# EAGLE design M240B (EAGLE 4.11)
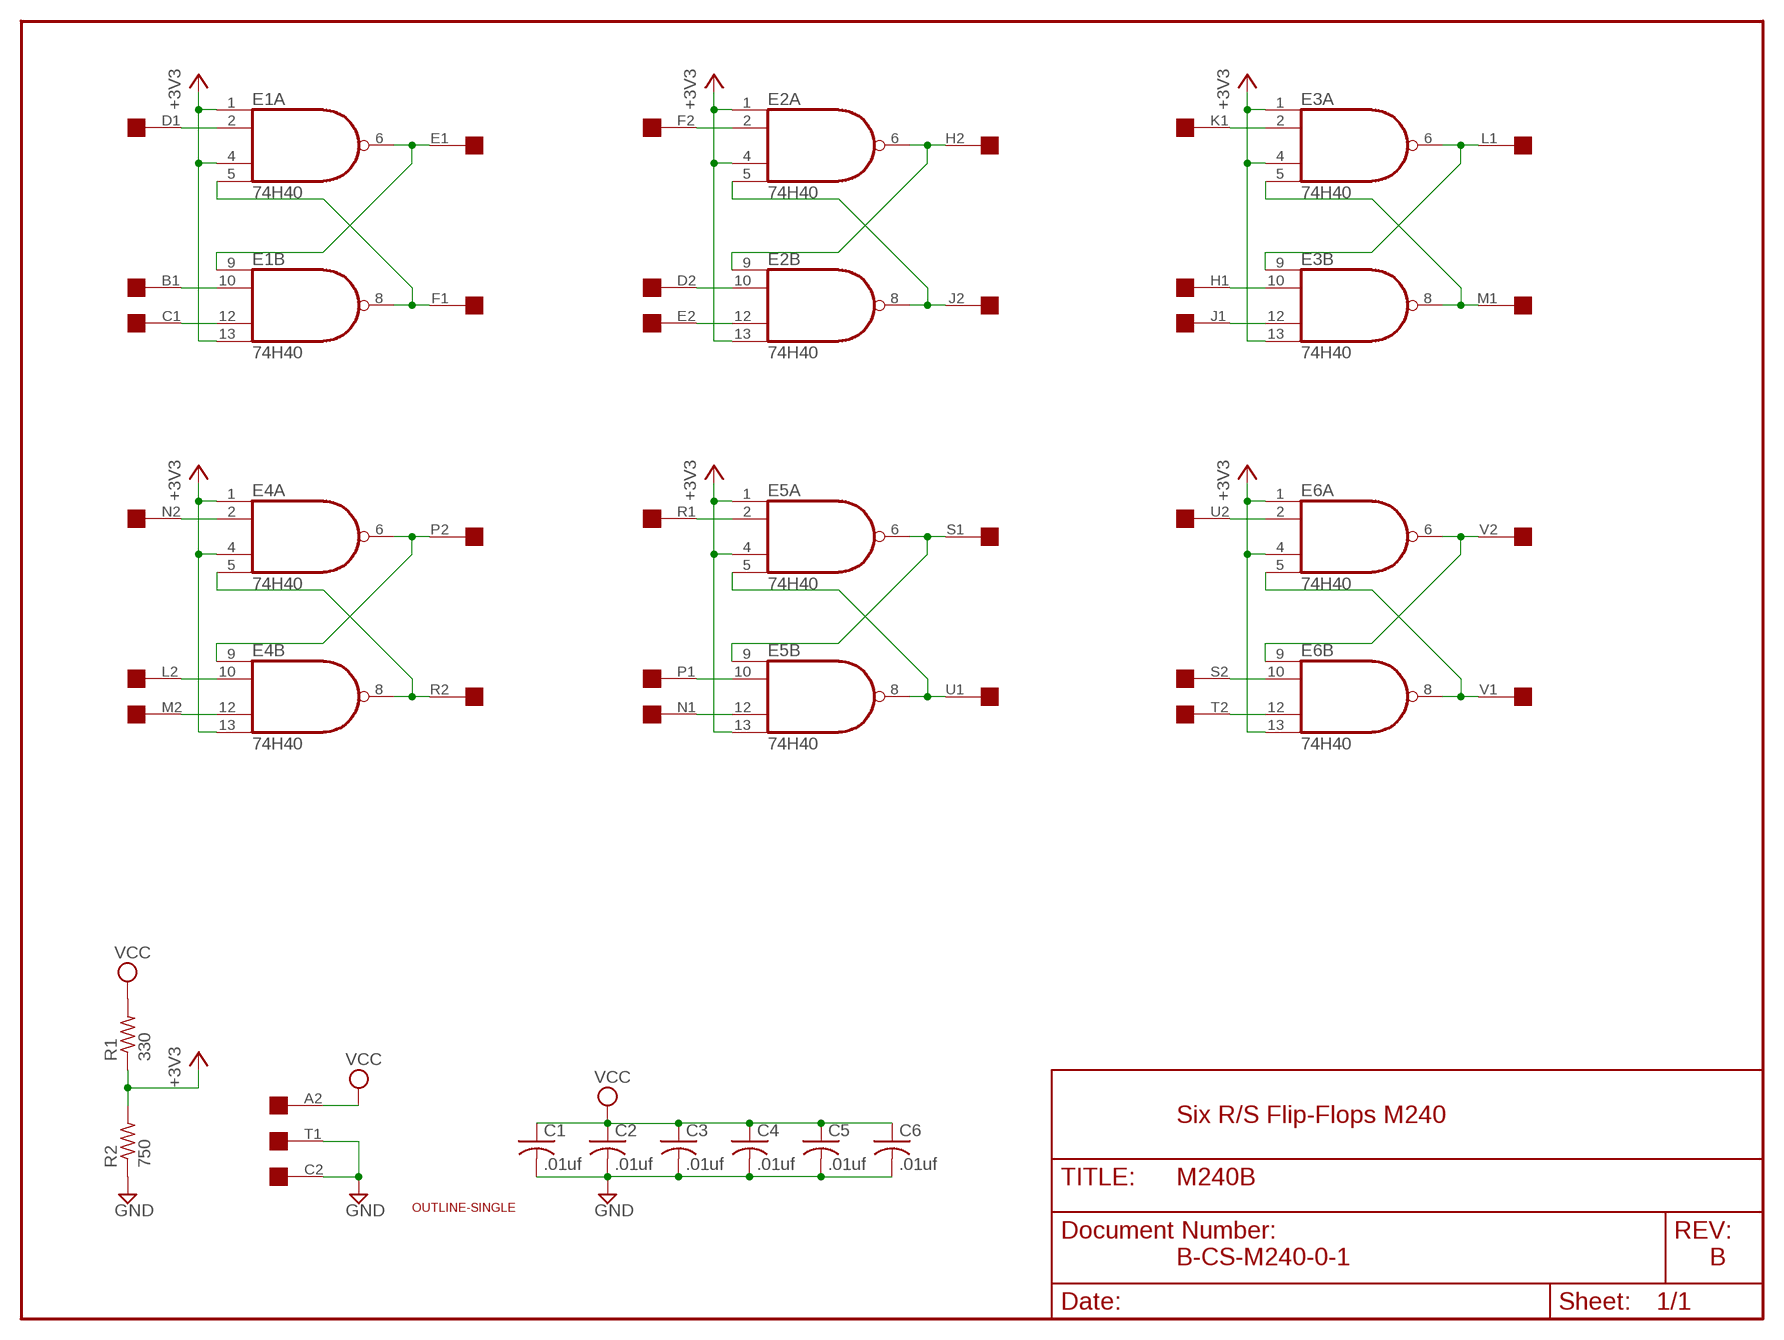
[diagram p0: schematic, sheet 1]

## Parts
C1  .01uf  C-US050-025X075  [C050-025X075]
C2  .01uf  C-US050-025X075  [C050-025X075]
C3  .01uf  C-US050-025X075  [C050-025X075]
C4  .01uf  C-US050-025X075  [C050-025X075]
C5  .01uf  C-US050-025X075  [C050-025X075]
C6  .01uf  C-US050-025X075  [C050-025X075]
E1  74H40  74S20N  [DIL14]
E2  74H40  74S20N  [DIL14]
E3  74H40  74S20N  [DIL14]
E4  74H40  74S20N  [DIL14]
E5  74H40  74S20N  [DIL14]
E6  74H40  74S20N  [DIL14]
R1  330  R-US_0207/10  [0207/10]
R2  750  R-US_0207/10  [0207/10]
U$1  OUTLINE-SINGLE  [SINGLE]
U$4  SINGLE  [EDGE-CON2]

## Nets
+3V3: E1.1(A:I0) E1.4(A:I2) E1.13(B:I3) E2.1(A:I0) E2.4(A:I2) E2.13(B:I3) E3.1(A:I0) E3.4(A:I2) E3.13(B:I3) E4.1(A:I0) E4.4(A:I2) E4.13(B:I3) E5.1(A:I0) E5.4(A:I2) E5.13(B:I3) E6.1(A:I0) E6.4(A:I2) E6.13(B:I3) R1.1 R2.2
GND [Supply]: C1.2 C2.2 C3.2 C4.2 C5.2 C6.2 R2.1 U$4.C2 U$4.T1
N$14: E1.6(A:O) E1.9(B:I0) U$4.E1
N$41: E1.5(A:I3) E1.8(B:O) U$4.F1
N$43: E1.2(A:I1) U$4.D1
N$44: E1.10(B:I1) U$4.B1
N$45: E1.12(B:I2) U$4.C1
N$46: E2.6(A:O) E2.9(B:I0) U$4.H2
N$47: E2.5(A:I3) E2.8(B:O) U$4.J2
N$48: E2.2(A:I1) U$4.F2
N$49: E2.10(B:I1) U$4.D2
N$50: E2.12(B:I2) U$4.E2
N$51: E3.6(A:O) E3.9(B:I0) U$4.L1
N$52: E3.5(A:I3) E3.8(B:O) U$4.M1
N$53: E3.2(A:I1) U$4.K1
N$54: E3.10(B:I1) U$4.H1
N$55: E3.12(B:I2) U$4.J1
N$56: E4.6(A:O) E4.9(B:I0) U$4.P2
N$57: E4.5(A:I3) E4.8(B:O) U$4.R2
N$58: E4.2(A:I1) U$4.N2
N$59: E4.10(B:I1) U$4.L2
N$60: E4.12(B:I2) U$4.M2
N$61: E5.6(A:O) E5.9(B:I0) U$4.S1
N$62: E5.5(A:I3) E5.8(B:O) U$4.U1
N$63: E5.2(A:I1) U$4.R1
N$64: E5.10(B:I1) U$4.P1
N$65: E5.12(B:I2) U$4.N1
N$66: E6.6(A:O) E6.9(B:I0) U$4.V2
N$67: E6.5(A:I3) E6.8(B:O) U$4.V1
N$68: E6.2(A:I1) U$4.U2
N$69: E6.10(B:I1) U$4.S2
N$70: E6.12(B:I2) U$4.T2
VCC [Supply]: C1.1 C2.1 C3.1 C4.1 C5.1 C6.1 R1.2 U$4.A2
Unconnected: U$4.A1 U$4.B2 U$4.K2

## Notes on the sheet
- Six R/S Flip-Flops M240
- B-CS-M240-0-1 | B

## Power pins joined to a net without a drawn wire
GND: E1.7(P:GND) E2.7(P:GND) E3.7(P:GND) E4.7(P:GND) E5.7(P:GND) E6.7(P:GND)
VCC: E1.14(P:VCC) E2.14(P:VCC) E3.14(P:VCC) E4.14(P:VCC) E5.14(P:VCC) E6.14(P:VCC)

## Library data of the parts
C1-C6 = rcl:C-US: CAPACITOR, American symbol
E1-E6 = 74xx-us:74*20: Dual 4-input NAND gate
R1 R2 = rcl:R-US_: RESISTOR, American symbol
U$1 = dec-con:OUTLINE-*: Board outlines for DEC boards.
U$4 = dec-con:SINGLE: Single-Height DEC board

## Net classes
1 Supply: width 0.813 mm

## Board
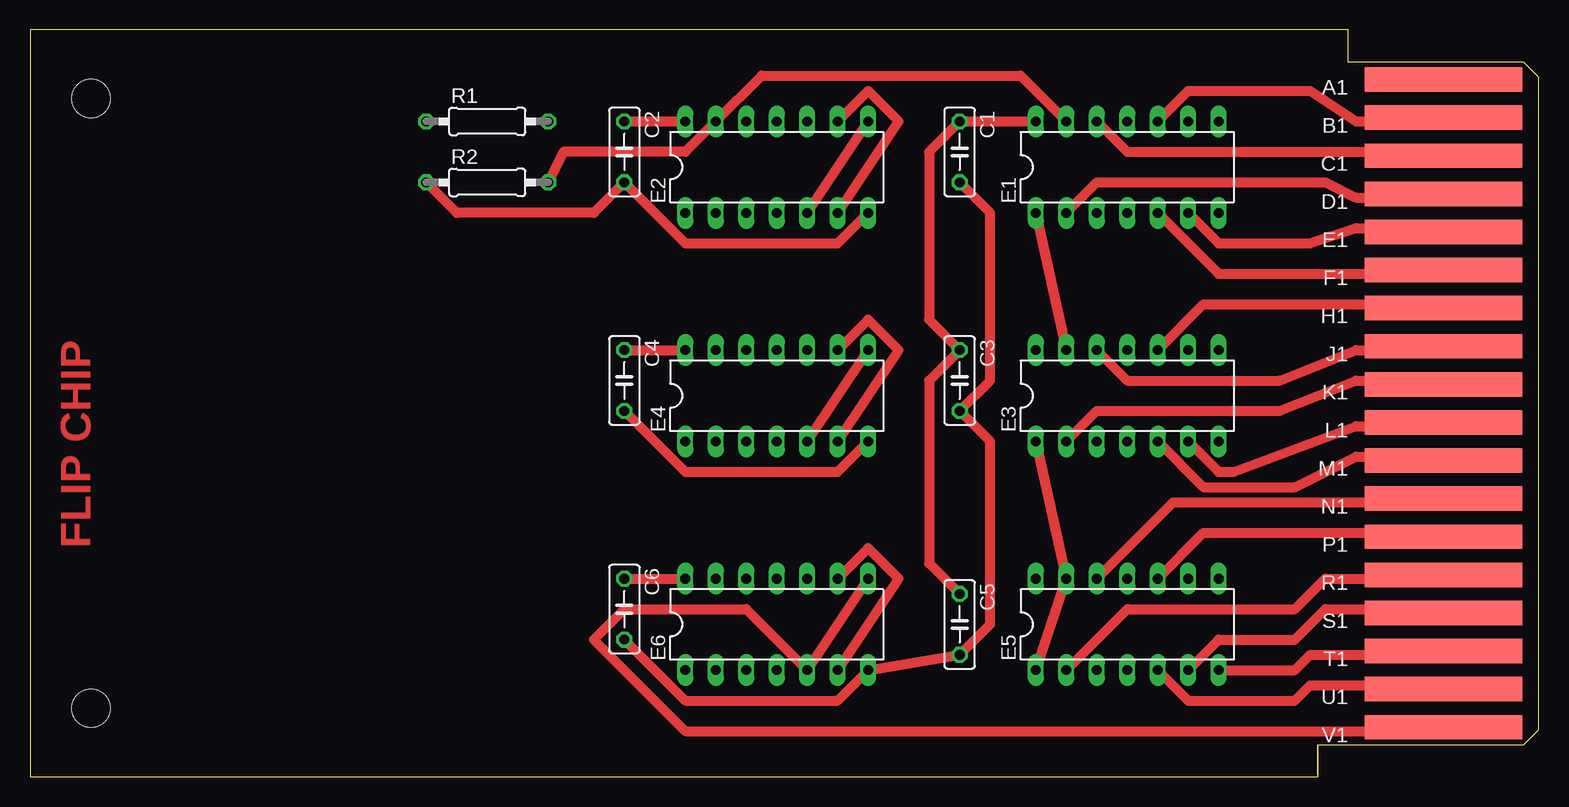
[diagram p1: board, top side]
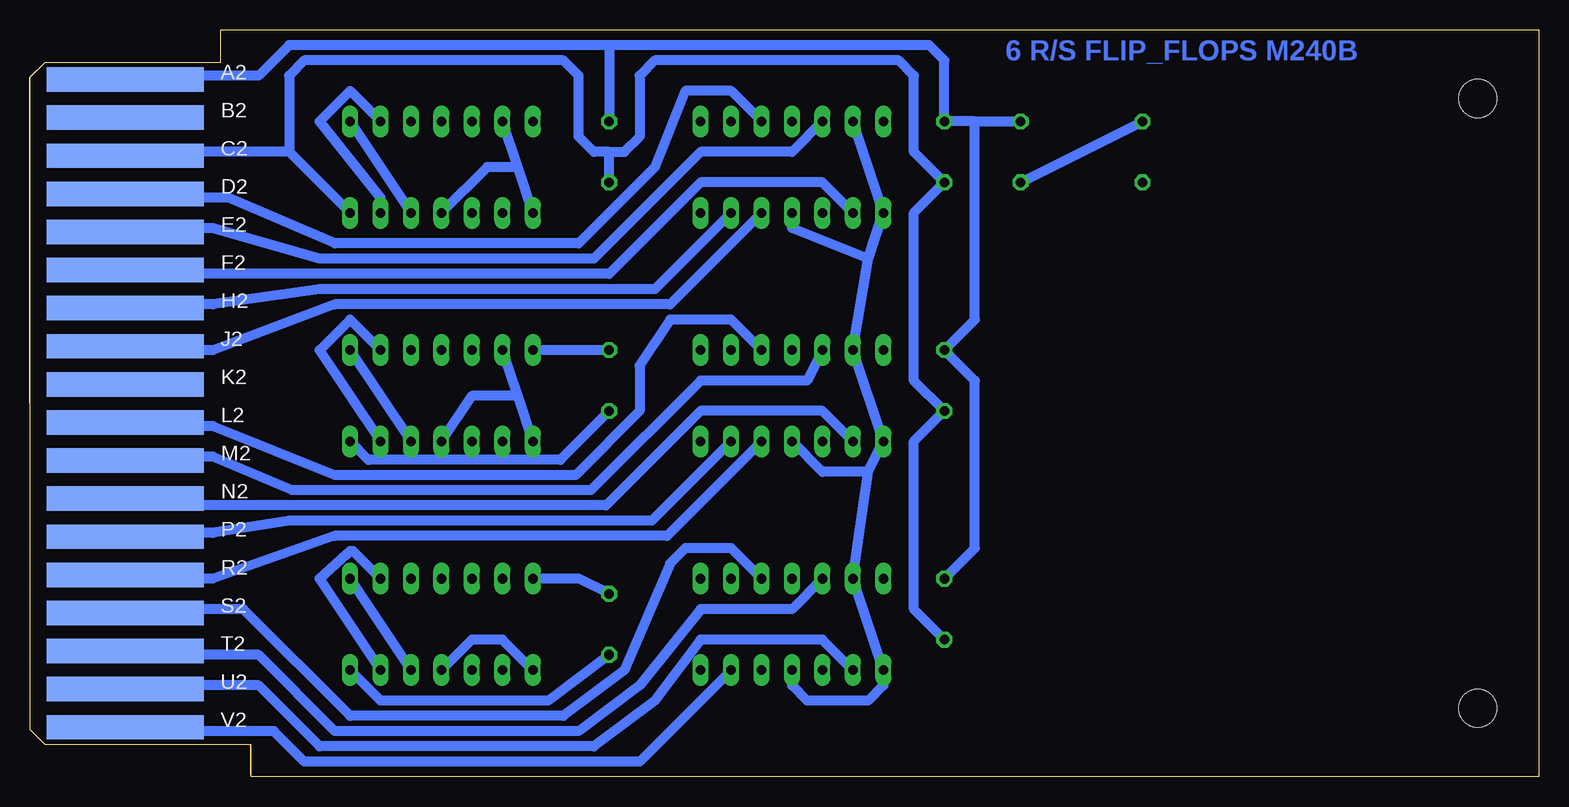
[diagram p2: board, bottom side, seen from below]

Size 125.73 x 62.23 mm. Coordinates in mm from the lower left corner, seen from the top.
Copper layers (1+16): Top 0.035mm / dielectric 1.5mm / Bottom 0.035mm
Design rules "16mils": minimum track width 16mil, minimum drill 32mil, track to track 15mil, track to pad 10mil, pad to pad 10mil, via to via 10mil, smd to smd 10mil, copper to edge 13mil, drill to drill 10mil, minimum pad ring 10mil, minimum via ring 8mil, stop-mask expansion 0mil, vias tented up to drill 0mil, thermal gap 10mil

### Footprints (pad centres in the part's own frame; a part is rotated, then mirrored left to right if it is on the bottom)
C050-025X075 = drill 0.813 octagon: 1 -2.54,0; 2 2.54,0
DIL14 = drill 0.813 long: 1 -7.62,-3.81; 2 -5.08,-3.81; 3 -2.54,-3.81; 4 0,-3.81; 5 2.54,-3.81; 6 5.08,-3.81; 7 7.62,-3.81; 8 7.62,3.81; 9 5.08,3.81; 10 2.54,3.81; 11 0,3.81; 12 -2.54,3.81; 13 -5.08,3.81; 14 -7.62,3.81
0207/10 = drill 0.813 octagon: 1 -5.08,0; 2 5.08,0
SINGLE = hole 3.175: 120.65,56.515; 120.65,5.715
EDGE-CON2 = smd 13.106 x 2.032: A1 7.938,4.128; B1 7.938,7.303; C1 7.938,10.477; D1 7.938,13.652; E1 7.938,16.828; F1 7.938,20.003; H1 7.938,23.177; J1 7.938,26.352; K1 7.938,29.527; L1 7.938,32.703; M1 7.938,35.877; N1 7.938,39.053; P1 7.938,42.227; R1 7.938,45.403; S1 7.938,48.578; T1 7.938,51.752; U1 7.938,54.928; V1 7.938,58.102 | smd 13.106 x 2.032 bottom: A2 7.938,4.128; B2 7.938,7.303; C2 7.938,10.477; D2 7.938,13.652; E2 7.938,16.828; F2 7.938,20.003; H2 7.938,23.177; J2 7.938,26.352; K2 7.938,29.527; L2 7.938,32.703; M2 7.938,35.877; N2 7.938,39.053; P2 7.938,42.227; R2 7.938,45.403; S2 7.938,48.578; T2 7.938,51.752; U2 7.938,54.928; V2 7.938,58.102

### Placement (x,y rotation side)
C1  77.47,52.07 270 top
C2  49.53,52.07 270 top
C3  77.47,33.02 270 top
C4  49.53,33.02 270 top
C5  77.47,12.7 270 top
C6  49.53,13.97 270 top
E1  91.44,50.8 0 top
E2  62.23,50.8 0 top
E3  91.44,31.75 0 top
E4  62.23,31.75 0 top
E5  91.44,12.7 0 top
E6  62.23,12.7 0 top
R1  38.1,54.61 0 top
R2  38.1,49.53 0 top
U$1  125.73,62.23 180 top
U$4  125.73,62.23 180 top
U$5  [FLIPCHIP]  0,0 0 top

### Tracks (layer width: path | path; a pad name or v marks a point on that pad's centre or on a via)
+3V3
  Top 0.813: R2.2 44.45,52.07 54.61,52.07 E2.13 60.96,58.42 82.55,58.42 E1.13 | E1.1 E3.13 | E3.1 E5.13 E5.1
  Bottom 0.813: E6.4 62.23,7.62 60.96,6.35 55.88,6.35 54.61,7.62 E6.1 E6.13 55.88,25.4 | R2.2 R1.1 | 85.09,50.8 E1.1 | E1.13 85.09,50.8 | E1.4 87.63,50.8 85.09,50.8 | E2.13 E2.1 55.88,43.18 | E2.4 62.23,45.72 55.88,43.18 | 55.88,43.18 E4.13 E4.1 55.88,25.4 | E4.4 59.69,25.4 55.88,25.4 | E5.1 86.36,11.43 88.9,11.43 E5.4 | 85.09,31.75 E3.1 | E3.13 85.09,31.75 | E3.4 88.9,31.75 85.09,31.75
GND
  Top 0.813: U$4.T1 116.84,10.16 106.68,10.16 105.41,8.89 E5.7 | C6.2 54.61,6.35 67.31,6.35 E6.7 C5.2 80.01,12.7 80.01,27.94 C3.2 80.01,33.02 80.01,46.99 C1.2 | R2.1 35.56,46.99 46.99,46.99 C2.2 54.61,44.45 67.31,44.45 E2.7 | E4.7 67.31,25.4 54.61,25.4 C4.2
  Bottom 0.813: C6.2 52.07,13.97 52.07,27.94 C4.2 52.07,33.02 52.07,46.99 C2.2 52.07,52.07 52.07,58.42 53.34,59.69 73.66,59.69 74.93,58.42 74.93,53.34 76.2,52.07 77.47,52.07 | U$4.C2 117.17,51.74 116.84,52.07 104.14,52.07 | 104.14,52.07 E1.7 | 77.47,52.07 78.74,52.07 80.01,53.34 80.01,58.42 81.28,59.69 102.87,59.69 104.14,58.42 104.14,52.07 | C1.2 77.47,52.07 | C5.2 82.55,6.35 96.52,6.35 E5.7 | E3.7 97.54,26.42 81.53,26.42 C3.2
N$14
  Top 0.813: U$4.E1 116.84,45.72 110.49,45.72 106.68,44.45 99.06,44.45 E1.6
  Bottom 0.813: E1.6 96.52,48.26 101.6,54.61 99.06,57.15 E1.9
N$41
  Top 0.813: U$4.F1 116.84,41.91 99.06,41.91 E1.5
  Bottom 0.813: E1.5 E1.8
N$43
  Top 0.813: U$4.D1 116.84,48.26 110.49,48.26 107.95,49.53 88.9,49.53 E1.2
N$44
  Top 0.813: U$4.B1 116.84,54.61 110.49,54.61 106.68,57.15 96.52,57.15 E1.10
N$45
  Top 0.813: U$4.C1 116.84,52.07 91.44,52.07 E1.12
N$46
  Top 0.813: E2.6 72.39,54.61 69.85,57.15 E2.9
  Bottom 0.813: U$4.H2 116.84,39.37 110.49,39.37 101.6,40.64 73.66,40.64 E2.6
N$47
  Top 0.813: E2.5 E2.8
  Bottom 0.813: U$4.J2 116.84,35.56 110.49,35.56 100.33,39.37 72.39,39.37 E2.5
N$48
  Bottom 0.813: U$4.F2 116.84,41.91 77.47,41.91 69.85,49.53 59.69,49.53 E2.2
N$49
  Bottom 0.813: U$4.D2 116.84,48.26 109.22,48.26 100.33,44.45 80.01,44.45 73.66,50.8 71.12,57.15 67.31,57.15 E2.10
N$50
  Bottom 0.813: U$4.E2 116.84,45.72 110.49,45.72 101.6,43.18 78.74,43.18 69.85,52.07 62.23,52.07 E2.12
N$51
  Top 0.813: U$4.L1 116.84,29.21 110.49,29.21 100.33,25.4 99.06,25.4 E3.6
  Bottom 0.813: E3.6 101.6,35.56 99.06,38.1 E3.9
N$52
  Top 0.813: U$4.M1 116.84,26.67 110.49,26.67 105.41,24.13 97.79,24.13 E3.5
  Bottom 0.813: E3.5 E3.8
N$53
  Top 0.813: U$4.K1 116.84,33.02 110.49,33.02 104.14,30.48 88.9,30.48 E3.2
N$54
  Top 0.813: U$4.H1 116.84,39.37 97.79,39.37 E3.10
N$55
  Top 0.813: U$4.J1 116.84,35.56 110.49,35.56 104.14,33.02 91.44,33.02 E3.12
N$56
  Top 0.813: E4.6 72.39,35.56 69.85,38.1 E4.9
  Bottom 0.813: U$4.P2 116.84,20.32 110.49,20.32 104.14,21.34 73.91,21.34 E4.6
N$57
  Top 0.813: E4.5 E4.8
  Bottom 0.813: U$4.R2 116.84,16.51 110.49,16.51 100.33,20.07 72.64,20.07 E4.5
N$58
  Bottom 0.813: U$4.N2 116.84,22.61 77.72,22.61 69.85,30.48 59.69,30.48 E4.2
N$59
  Bottom 0.813: U$4.L2 116.84,29.21 110.49,29.21 100.33,25.15 80.26,25.15 74.93,30.48 74.93,34.29 72.39,38.1 67.31,38.1 E4.10
N$60
  Bottom 0.813: U$4.M2 116.84,26.67 110.49,26.67 103.89,23.88 78.99,23.88 69.85,33.02 60.96,33.02 E4.12
N$61
  Top 0.813: U$4.S1 116.84,13.97 107.95,13.97 105.41,11.43 99.06,11.43 E5.6
  Bottom 0.813: E5.9 98.81,18.8 99.06,18.8 99.31,18.54 101.6,16.51 E5.6
N$62
  Top 0.813: U$4.U1 116.84,7.62 106.68,7.62 105.41,6.35 96.52,6.35 E5.5
  Bottom 0.813: E5.5 E5.8
N$63
  Top 0.813: U$4.R1 116.84,16.51 107.95,16.51 105.41,13.97 91.44,13.97 E5.2
N$64
  Top 0.813: U$4.P1 116.84,20.32 97.79,20.32 E5.10
N$65
  Top 0.813: U$4.N1 116.84,22.86 95.25,22.86 E5.12
N$66
  Top 0.813: E6.6 72.39,16.51 69.85,19.05 E6.9
  Bottom 0.813: U$4.V2 117.23,4.2 116.84,3.81 105.41,3.81 102.87,1.27 74.93,1.27 E6.6
N$67
  Top 0.813: U$4.V1 116.84,3.81 54.61,3.81 46.99,11.43 49.53,13.97 59.69,13.97 E6.5 E6.8
N$68
  Bottom 0.813: U$4.U2 117.2,7.26 116.84,7.62 106.68,7.62 101.6,2.54 78.74,2.54 73.66,6.35 69.85,11.43 59.69,11.43 E6.2
N$69
  Bottom 0.813: U$4.S2 116.84,13.97 107.95,13.97 99.06,5.08 81.28,5.08 76.2,8.89 72.39,17.78 71.12,19.05 67.31,19.05 E6.10
N$70
  Bottom 0.813: U$4.T2 115.9,10.49 115.57,10.16 106.68,10.16 100.33,3.81 80.01,3.81 74.93,7.62 69.85,13.97 62.23,13.97 E6.12
VCC
  Top 0.813: C6.1 E6.14 | C4.1 E4.14 | C2.1 E2.14 | C5.1 74.93,17.78 74.93,33.02 C3.1 74.93,38.1 74.93,52.07 C1.1 E1.14
  Bottom 0.813: C6.1 46.99,19.05 46.99,33.02 C4.1 46.99,38.1 46.99,54.61 | 46.99,54.61 C2.1 49.53,59.69 50.8,60.96 77.47,60.96 | 46.99,54.61 R1.2 | U$4.A2 117.24,58.02 116.84,58.42 106.68,58.42 104.14,60.96 77.47,60.96 | 77.47,60.96 C1.1 | C5.1 80.01,16.51 E5.14 | C3.1 E3.14

### Text on the board
Bottom: 6 R/S FLIP_FLOPS M240B